# EasyEDA Pro project ProPrj_SRC_Robot2025_V1.0_2026-09-06.epro, schematic Schematic-MOTOR
Board Name: Motor_Driver; Create Date: 2025-06-29; Page Name: Sheet3A; Project Name: SRC_Robot2025_V1.0; Schematic Name: Schematic-MOTOR; Update Date: 2025-07-21; Address1: *; Address2: *; Address3: *; Address4: *; Application_BuildNumber: *; ApprovedBy: *; Author: *; CheckedBy: *; CompanyName: *; CurrentDate: *; CurrentTime: *; Date: *; DocumentFullPathAndName: *; DocumentName: *; DocumentNumber: *; DrawnBy: *; Engineer: *; ImagePath: *; ModifiedDate: *; Organization: *; ProjectName: *; Revision: *; Rule: *; SheetNumber: *; SheetTotal: *; Time: *; Title: *
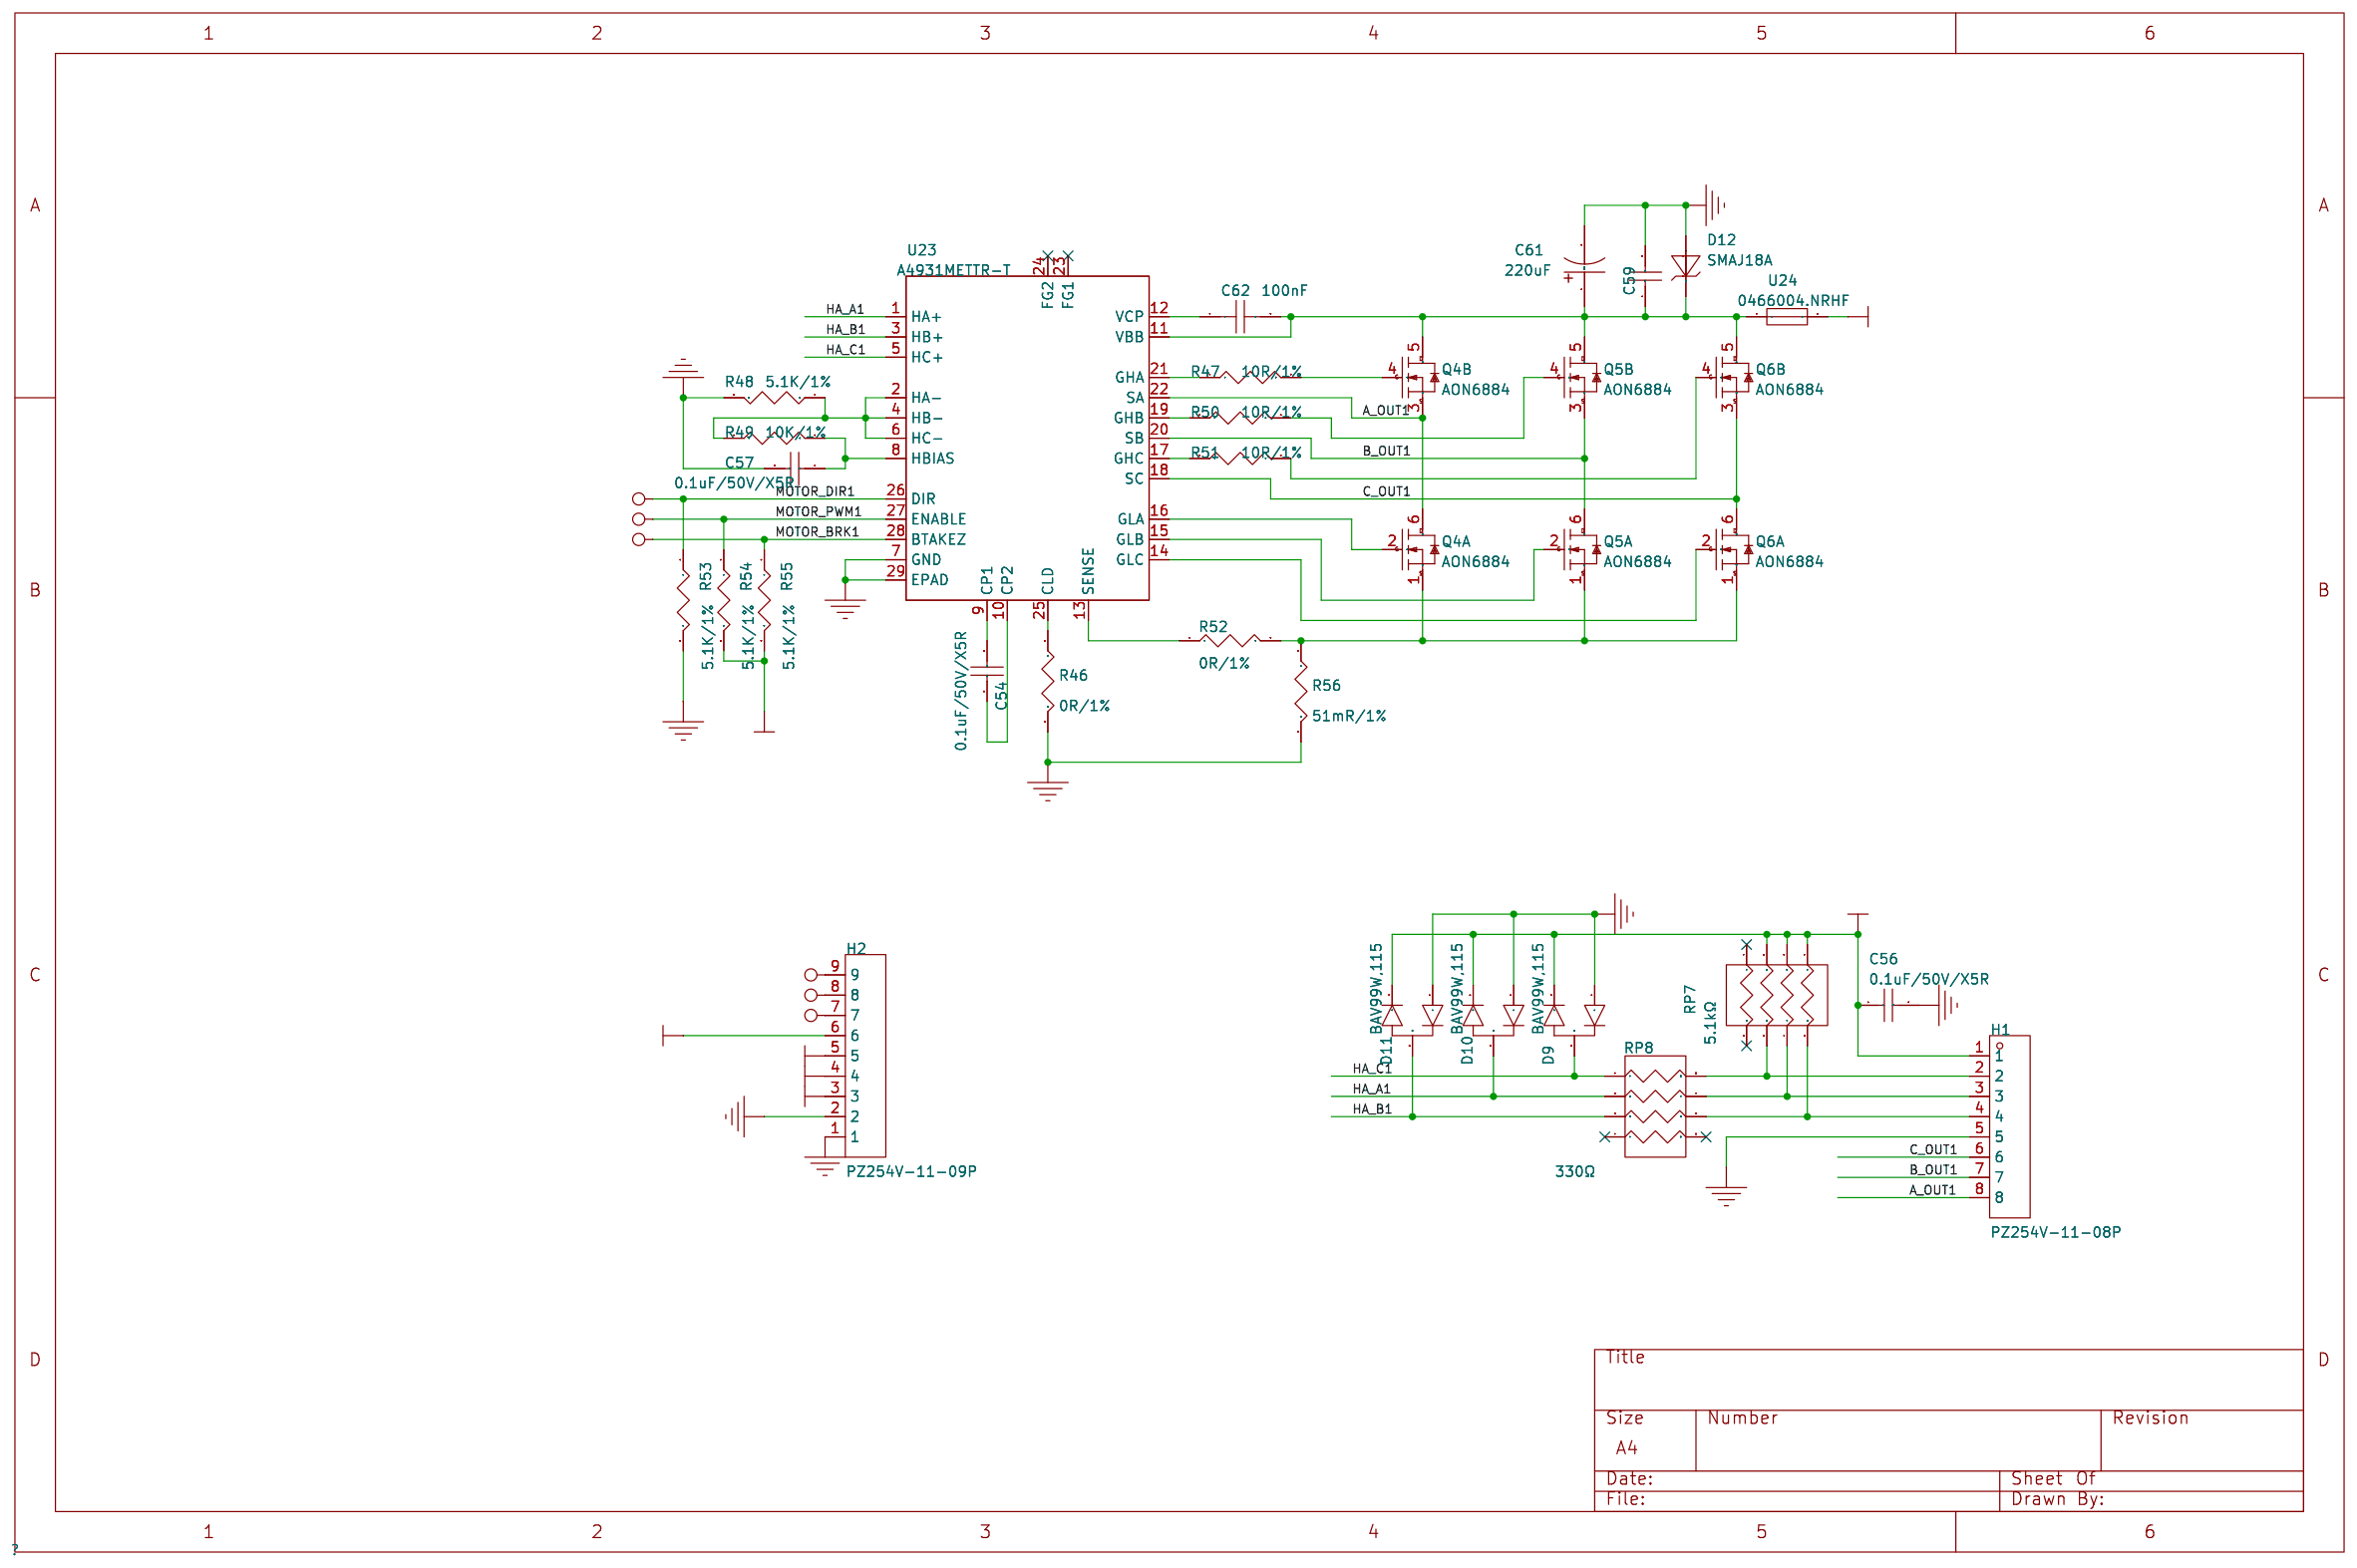
[diagram p8: schematic sheet]

## Parts
C54  100pF  [C0603]
C56  100pF  [C0603]
C57  100pF  [C0603]
C59  4.7uF  [C0603]
C61  220uF  [CAP-SMD_BD6.3-L6.6-W6.6-LS7.8-FD]
C62  100nF  [C0603]
D9  BAV99W,115  [SOT-323_L2.0-W1.3-P1.30-LS2.1-BR]
D10  BAV99W,115  [SOT-323_L2.0-W1.3-P1.30-LS2.1-BR]
D11  BAV99W,115  [SOT-323_L2.0-W1.3-P1.30-LS2.1-BR]
D12  SMAJ18A  [SMA_L4.3-W2.6-LS5.1-RD]
H1  PZ254V-11-08P  [HDR-TH_8P-P2.54-V-M]
H2  PZ254V-11-09P  [HDR-TH_9P-P2.54-V-M]
Q4  AON6884  [DFN-8_L5.5-W5.2-P1.27-LS6.0-BL-EP2]  (sections 1,2)
Q5  AON6884  [DFN-8_L5.5-W5.2-P1.27-LS6.0-BL-EP2]  (sections 1,2)
Q6  AON6884  [DFN-8_L5.5-W5.2-P1.27-LS6.0-BL-EP2]  (sections 1,2)
R46  1K  [R0603]
R47  1K  [R0603]
R48  1K  [R0603]
R49  1K  [R0603]
R50  1K  [R0603]
R51  1K  [R0603]
R52  1K  [R0603]
R53  1K  [R0603]
R54  1K  [R0603]
R55  1K  [R0603]
R56  1K  [R0805]
RP7  5.1kΩ  [RES-ARRAY-SMD_0603-8P-L3.2-W1.6-BL]
RP8  330Ω  [RES-ARRAY-SMD_0603-8P-L3.2-W1.6-BL]
U23  A4931METTR-T  [WQFN-28_L5.0-W5.0-P0.50-BL-EP3.2]
U24  0466004.NRHF  [F1206]

## Library data of the parts
C54 C56 C57 = 0.1uF/50V/X5R: Capacitor (Semiconductor SIM Model); Published: 8-Jun-2000; LatestRevisionDate: 29-May-2009; LatestRevisionNote: IPC-7351 Footprint Added.; PackageReference: C1206; Publisher: Altium Limited; PackageDescription: Chip Capacitor; Design Item ID: Cap Semi; Library Name: Miscellaneous Devices
C59 = CGA0603X5R475K250JT: 容值:4.7uF;精度:±10%;额定电压:25V;温度系数:X5R;; LCSC Part Name: 4.7uF ±10% 25V; Supplier Part: C6119856; Manufacturer: HRE(芯声); Supplier Footprint: 0603; JLCPCB Part Class: Extended Part; Supplier: LCSC; Tolerance: ±10%; Voltage Rating: 25V; Temperature Coefficient: X5R
C61 = 126RV0120: 容值:220uF;精度:±20%;额定电压:16V;纹波电流:110mA;; LCSC Part Name: 220uF ±20% 16V; Supplier Part: C7461251; Manufacturer: KNSCHA(科尼盛); Supplier Footprint: SMD,D6.3xL5.4mm; JLCPCB Part Class: Extended Part; Datasheet: https://atta.szlcsc.com/upload/public/pdf/source/20230711/C31DDA6C327C328728F6E1F6C249EBC7.pdf; Supplier: LCSC; Tolerance: ±20%; Rated Voltage: 16V; Ripple Current: 110mA; φD: 6.3mm; L: 5.4mm; Lifetime @ Temp: 2000hrs@105℃; Operating Temperature: -55℃~+105℃
C62 = CGA0603X7R104K500JT: 容值:100nF;精度:±10%;额定电压:50V;材质(温度系数):X7R;; LCSC Part Name: 100nF ±10% 50V; Supplier Part: C6119867; Manufacturer: HRE(芯声); Supplier Footprint: 0603; JLCPCB Part Class: 扩展库; Supplier: LCSC; Tolerance: ±10%; Voltage Rated: 50V; Temperature Coefficient: X7R
D9-D11 = BAV99W,115: 二极管配置:1对串联式;正向压降(Vf):1.25V@150mA;直流反向耐压(Vr):100V;平均整流电流(Io):150mA;功率:200mW;反向恢复时间(trr):4ns;; LCSC Part Name: 电压:100V 电流:150mA; Supplier Part: C8662; Manufacturer: Nexperia(安世); Supplier Footprint: SOT-323-3; JLCPCB Part Class: Extended Part; Datasheet: https://atta.szlcsc.com/upload/public/pdf/source/20151007/1457707429518.pdf; Supplier: LCSC; Diode Configuration: 1对串联式; Forward Voltage (Vf@If): 1.25V@150mA; Reverse Voltage (Vr): 100V; Average Rectified Current (Io): 150mA; Power Dissipation: 200mW; Reverse Leakage Current: 500nA@80V; Reverse Recovery Time (trr): 4ns
D12 = SMAJ18A_C908771: 反向截止电压(Vrwm):18V;最大钳位电压:29.2V;峰值脉冲电流(Ipp):13.7A;峰值脉冲功率(Ppp):400W;击穿电压:20V;; LCSC Part Name: 单向TVS 18V截止 13.7A峰值脉冲; Supplier Part: C908771; Manufacturer: GOODWORK(固得沃克); Supplier Footprint: SMA(DO-214AC); JLCPCB Part Class: 扩展库; Datasheet: https://atta.szlcsc.com/upload/public/pdf/source/20240508/8B44FA02DF89A45C8C3EB0325515EF7C.pdf; Supplier: LCSC; Reverse Stand-Off Voltage (Vrwm): 18V; Maximum Clamping Voltage: 29.2V; Peak Pulse Current (Ipp): 13.7A; Peak Pulse Power Dissipation (Ppp): 400W; Breakdown Voltage: 20V; Reverse Leakage Current (Ir): 5uA; Operating Temperature: -55℃~+150℃@(Tj); Type: TVS
H1 = PZ254V-11-08P: 插针结构:1x8P;间距:2.54mm;行距:-;圆针/方针:方针;安装类型:直插;排数:单排;总PIN位数:8P;额定电流:-;额定电压:-;配合针长度:6mm;塑高:2.5mm;端接针长度:3mm;触头材质:黄铜;触头镀层:-;工作温度范围:-40℃~+105℃;颜色:黑色;; LCSC Part Name: 间距:2.54mm 1x8P 直插 方针; Supplier Part: C492407; Manufacturer: XFCN(兴飞); Supplier Footprint: 插件,P=2.54mm; JLCPCB Part Class: 扩展库; Datasheet: https://atta.szlcsc.com/upload/public/pdf/source/20200309/C492407_83A6FB26A2233368EDB9516968EC6149.pdf; Supplier: LCSC; Pin Structure: 1x8P; Pitch: 2.54mm; Circluar Pins/Square Pins: 方针; Mounting Type: 直插; Number of Rows: 单排; Number of Pins: 8P; Length of Mating Pin: 6mm; Insulation Height: 2.5mm; Length of End Connection Pin: 3mm; Contact Material: 黄铜; Operating Temperature Range: -40℃~+105℃; Color: 黑色
H2 = PZ254V-11-09P: 插针结构:1x9P;间距:2.54mm;行距:-;圆针/方针:方针;安装方式:直插;排数:单排;总PIN位数:9P;额定电流:-;额定电压:-;配合针长度:6mm;塑高:2.5mm;端接针长度:3mm;触头材质:黄铜;触头镀层:-;工作温度:-40℃~+105℃;颜色:黑色;; LCSC Part Name: 1x9P 间距:2.54mm 方针 直插; Supplier Part: C492408; Manufacturer: XFCN(兴飞); Supplier Footprint: 插件,P=2.54mm; JLCPCB Part Class: 扩展库; Datasheet: https://atta.szlcsc.com/upload/public/pdf/source/20200309/C492408_0CE6AEE885DD471CEFA4BE32B6482CF7.pdf; Supplier: LCSC; Pin Structure: 1x9P; Pitch: 2.54mm; Circluar Pins/Square Pins: 方针; Mounting Type: 直插; Number of Rows: 单排; Number of Pins: 9P; Length of Mating Pin: 6mm; Insulation Height: 2.5mm; Length of End Connection Pin: 3mm; Contact Material: 黄铜; Operating Temperature: -40℃~+105℃; Color: 黑色
Q4-Q6 = AON6884: 类型:2个N沟道;漏源电压(Vdss):40V;连续漏极电流(Id):34A;导通电阻(RDS(on)@Vgs,Id):11.3mΩ@10V;功率(Pd):21W;阈值电压(Vgs(th)@Id):2.7V@250uA;; LCSC Part Name: 2个N沟道 耐压:40V 电流:34A; Supplier Part: C125872; Manufacturer: AOS; Supplier Footprint: DFN-8(5.2x5.5); JLCPCB Part Class: Extended Part; Datasheet: https://atta.szlcsc.com/upload/public/pdf/source/20180326/C125872_34AF0DD57D8DED273B86A053347F87CE.pdf; Supplier: LCSC; Type: 2个N沟道; Drain Source Voltage (Vdss): 40V; Continuous Drain Current (Id): 34A; Drain Source On Resistance (RDS(on)@Vgs,Id): 11.3mΩ@10V; Power Dissipation (Pd): 21W; Gate Threshold Voltage (Vgs(th)@Id): 2.7V@250uA; Total Gate Charge (Qg@Vgs): 33nC@10V; Input Capacitance (Ciss@Vds): 1.95nF@20V; Reverse Transfer Capacitance (Crss@Vds): 190pF@20V; Operating Temperature: -55℃~+150℃
R46 R52 = 0R/1%: Resistor; Published: 8-Jun-2000; LatestRevisionDate: 29-May-2009; LatestRevisionNote: IPC-7351 Footprint Added.; PackageReference: J1-0603; Publisher: Altium Limited; PackageDescription: Chip Resistor; Design Item ID: Res3; Library Name: Miscellaneous Devices
R47 R50 R51 = 10R/1%: Resistor; Published: 8-Jun-2000; LatestRevisionDate: 29-May-2009; LatestRevisionNote: IPC-7351 Footprint Added.; PackageReference: J1-0603; Publisher: Altium Limited; PackageDescription: Chip Resistor; Design Item ID: Res3; Library Name: Miscellaneous Devices
R48 R53-R55 = 5.1K/1%: Resistor; Published: 8-Jun-2000; LatestRevisionDate: 29-May-2009; LatestRevisionNote: IPC-7351 Footprint Added.; PackageReference: J1-0603; Publisher: Altium Limited; PackageDescription: Chip Resistor; Design Item ID: Res3; Library Name: Miscellaneous Devices
R49 = 10K/1%: Resistor; Published: 8-Jun-2000; LatestRevisionDate: 29-May-2009; LatestRevisionNote: IPC-7351 Footprint Added.; PackageReference: J1-0603; Publisher: Altium Limited; PackageDescription: Chip Resistor; Design Item ID: Res3; Library Name: Miscellaneous Devices
R56 = 51mR/1%: Resistor; Published: 8-Jun-2000; LatestRevisionDate: 29-May-2009; LatestRevisionNote: IPC-7351 Footprint Added.; PackageReference: J1-0603; Publisher: Altium Limited; PackageDescription: Chip Resistor; Design Item ID: Res3; Library Name: Miscellaneous Devices
RP7 = YC164-JR-075K1L: 电阻器数:4;阻值:5.1kΩ;精度:±5%;单个元件功率:62.5mW;温度系数:±200ppm/℃;; LCSC Part Name: 5.1kΩ ±5% 0603x4; Supplier Part: C706478; Manufacturer: YAGEO(国巨); Supplier Footprint: 0603x4; JLCPCB Part Class: Extended Part; Datasheet: https://atta.szlcsc.com/upload/public/pdf/source/20181031/C326869_C8B113A8CFF0517934C636AB0D29A6BD.pdf; Supplier: LCSC; Number of Resistors: 4; Tolerance: ±5%; Power(Watts): 62.5mW; Temperature Coefficient: ±200ppm/℃; Number of Pins: 8
RP8 = 4D03WGJ0331T5E: 电阻器数:4;阻值:330Ω;精度:±5%;单个元件功率:62.5mW;温度系数:±200ppm/℃;; LCSC Part Name: 330Ω ±5% 0603x4; Supplier Part: C12018; Manufacturer: UNI-ROYAL(厚声); Supplier Footprint: 0603x4; JLCPCB Part Class: Extended Part; Datasheet: https://atta.szlcsc.com/upload/public/pdf/source/20191224/C474318_2527498AE30E813171187CCD28401A71.pdf; Supplier: LCSC; Number of Resistors: 4; Tolerance: ±5%; Power(Watts): 62.5mW; Temperature Coefficient: ±200ppm/℃; Number of Pins: 8
U23 = A4931METTR-T: 微功率，超灵敏，霍尔开关; LCSC Part Name: 无刷直流BLDC电机驱动芯片 37.5V; Supplier Part: C89724; Manufacturer: ALLEGRO(美国埃戈罗); Supplier Footprint: WQFN-28-EP(5x5); JLCPCB Part Class: Extended Part; Datasheet: https://atta.szlcsc.com/upload/public/pdf/source/20180122/C89724_15166131725631291885.pdf; Supplier: LCSC
U24 = 0466004.NRHF: 类型:贴片式保险丝;额定电流:4A;额定电压 (AC):32V;额定电压 (DC):32V;分断能力:50A;; LCSC Part Name: 32V贴片式保险丝; Supplier Part: C187596; Manufacturer: Littelfuse(美国力特); Supplier Footprint: 1206; JLCPCB Part Class: Extended Part; Datasheet: https://atta.szlcsc.com/upload/public/pdf/source/20180717/C206988_5F0E1BFD05A279C65E5494FD60374951.pdf; Supplier: LCSC; Type: 贴片式保险丝; Current Rating: 4A; Voltage Rating  (AC): 32V; Voltage Rating (DC): 32V; Operating Temperature: -55℃~+90℃; Breaking Capacity: 50A

## Nets
+3V3: H2.6 R54.2 R55.2
+5V: C56.1 D9.2 D10.2 D11.2 H1.1 H2.5 RP7.1 RP7.2 RP7.3
GND: C56.2 C57.2 C59.2 C61.2 D9.1 D10.1 D11.1 D12.2 H1.5 H2.1 H2.2 R46.2 R48.2 R53.2 R56.2 U23.7(GND) U23.29(EPAD)
VBAT: H2.3 H2.4 U24.2
A_OUT1: H1.8 Q4.3(S) Q4.6 U23.22(SA)
B_OUT1: H1.7 Q5.3(S) Q5.6 U23.20(SB)
C_OUT1: H1.6 Q6.3(S) Q6.6 U23.18(SC)
HA_A1: D10.3 RP8.2 U23.1(HA+)
HA_B1: D11.3 RP8.3 U23.3(HB+)
HA_C1: D9.3 RP8.1 U23.5(HC+)
MOTOR_BRK1: H2.7 R55.1 U23.28(BTAKEZ)
MOTOR_DIR1: H2.9 R53.1 U23.26(DIR)
MOTOR_PWM1: H2.8 R54.1 U23.27(ENABLE)
$1N2: C62.1 U23.12(VCP)
$1N4: R48.1 R49.1 U23.2(HA-) U23.4(HB-) U23.6(HC-)
$1N5: C57.1 R49.2 U23.8(HBIAS)
$1N10: R46.1 U23.25(CLD)
$1N16: C54.1 U23.9(CP1)
$1N17: C54.2 U23.10(CP2)
$1N18: R52.1 U23.13(SENSE)
$1N20: R47.1 U23.21(GHA)
$1N21: R50.1 U23.19(GHB)
$1N22: R51.1 U23.17(GHC)
$1N23: Q4.4(G) R47.2
$1N24: Q5.4(G) R50.2
$1N25: Q6.2(G) U23.14(GLC)
$1N26: Q5.2(G) U23.15(GLB)
$1N27: Q4.2(G) U23.16(GLA)
$1N28: Q4.1(S) Q5.1(S) Q6.1(S) R52.2 R56.1
$1N30: C59.1 C61.1 C62.2 D12.1 Q4.5(D) Q5.5(D) Q6.5(D) U23.11(VBB) U24.1
$1N34: Q6.4(G) R51.2
$1N40: H1.2 RP7.6 RP8.8
$1N41: H1.3 RP7.7 RP8.7
$1N42: H1.4 RP7.8 RP8.6

Not connected (* = marked no-connect by the designer): RP7 4* 5*; RP8 4* 5*; U23 23(FG1)* 24(FG2)*
